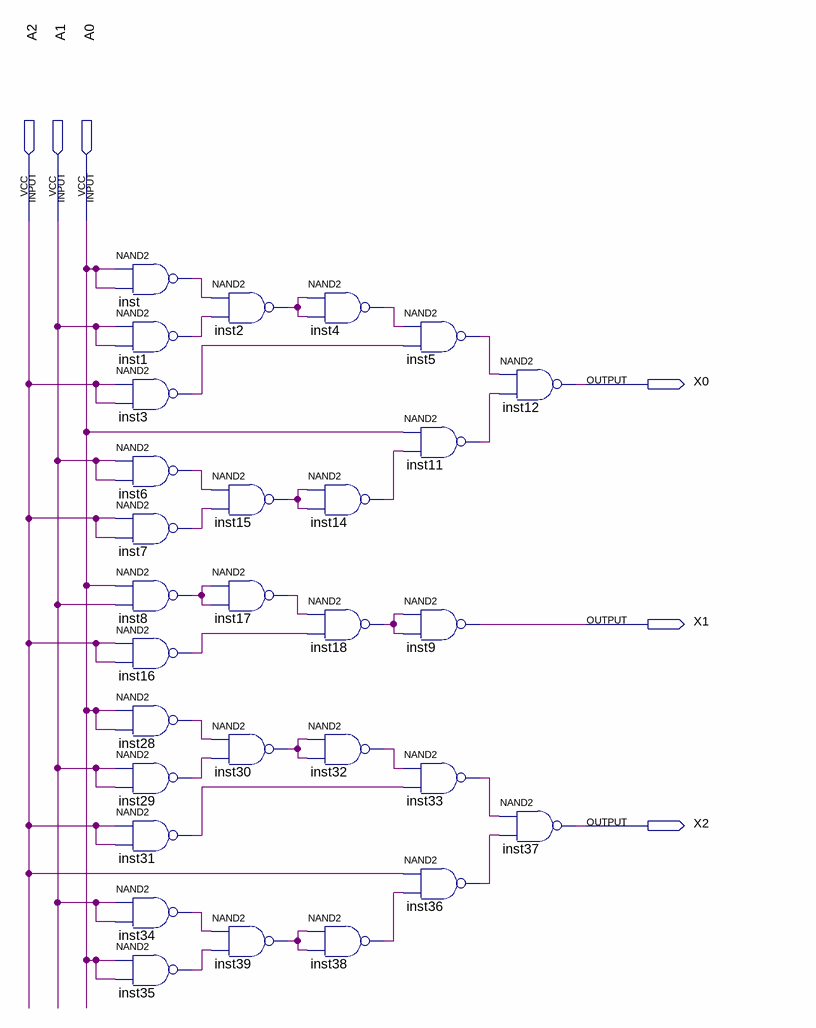
[diagram p0: schematic sheet]
// Quartus schematic SUB_new_my.bdf as structural Verilog: 29 symbols, 6 pins
module SUB_new_my (
  input  A2,
  input  A1,
  input  A0,
  output X0,
  output X1,
  output X2
);

  wire inst1_out, inst2_out, inst3_out, inst4_out, inst5_out, inst6_out, inst7_out, inst8_out, inst11_out,
       inst14_out, inst15_out, inst16_out, inst17_out, inst18_out, inst28_out, inst29_out, inst30_out,
       inst31_out, inst32_out, inst33_out, inst34_out, inst35_out, inst36_out, inst38_out, inst39_out,
       inst_out;

  nand inst (inst_out, A0, A0);
  nand inst1 (inst1_out, A1, A1);
  nand inst3 (inst3_out, A2, A2);
  nand inst6 (inst6_out, A1, A1);
  nand inst7 (inst7_out, A2, A2);
  nand inst8 (inst8_out, A0, A1);
  nand inst16 (inst16_out, A2, A2);
  nand inst28 (inst28_out, A0, A0);
  nand inst29 (inst29_out, A1, A1);
  nand inst31 (inst31_out, A2, A2);
  nand inst34 (inst34_out, A1, A1);
  nand inst35 (inst35_out, A0, A0);
  nand inst2 (inst2_out, inst_out, inst1_out);
  nand inst15 (inst15_out, inst6_out, inst7_out);
  nand inst17 (inst17_out, inst8_out, inst8_out);
  nand inst30 (inst30_out, inst28_out, inst29_out);
  nand inst39 (inst39_out, inst34_out, inst35_out);
  nand inst4 (inst4_out, inst2_out, inst2_out);
  nand inst14 (inst14_out, inst15_out, inst15_out);
  nand inst18 (inst18_out, inst17_out, inst16_out);
  nand inst32 (inst32_out, inst30_out, inst30_out);
  nand inst38 (inst38_out, inst39_out, inst39_out);
  nand inst5 (inst5_out, inst4_out, inst3_out);
  nand inst11 (inst11_out, A0, inst14_out);
  nand inst9 (X1, inst18_out, inst18_out);
  nand inst33 (inst33_out, inst32_out, inst31_out);
  nand inst36 (inst36_out, A2, inst38_out);
  nand inst12 (X0, inst5_out, inst11_out);
  nand inst37 (X2, inst33_out, inst36_out);
endmodule
